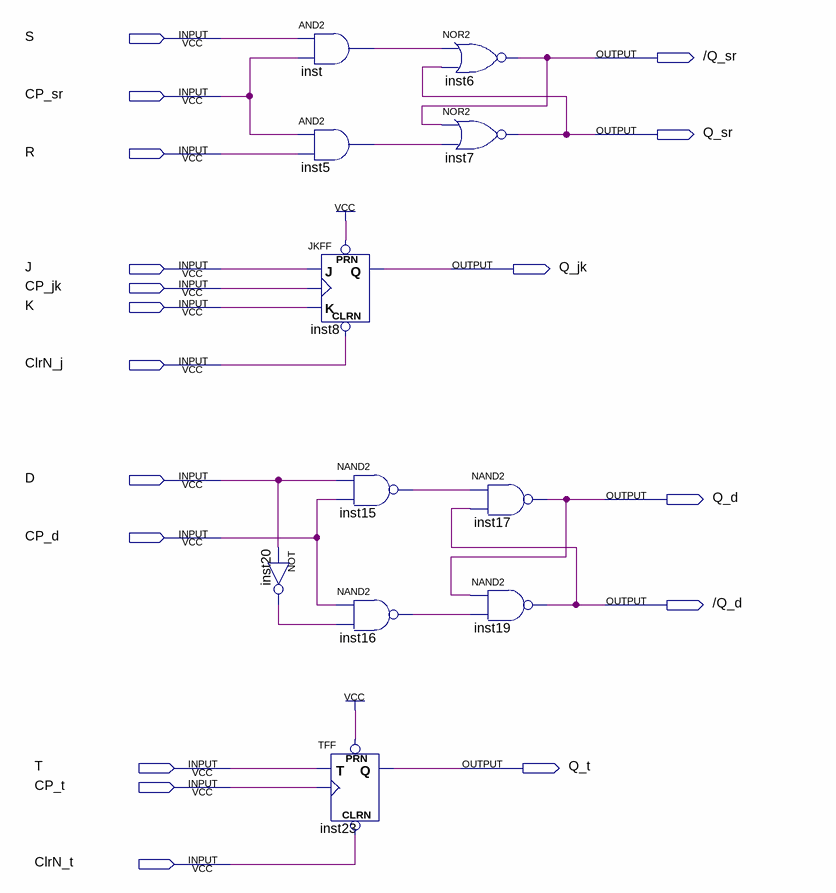
[diagram p0: schematic sheet]
// Quartus schematic ExampleCollection.bdf as structural Verilog: 11 symbols, 18 pins
module ExampleCollection (
  input  S,
  input  CP_sr,
  input  R,
  input  J,
  input  CP_jk,
  input  K,
  input  ClrN_j,
  input  D,
  input  CP_d,
  input  T,
  input  CP_t,
  input  ClrN_t,
  output \/Q_sr ,
  output Q_sr,
  output Q_jk,
  output Q_d,
  output \/Q_d ,
  output Q_t
);

  wire inst5_out, inst15_out, inst16_out, inst20_out, inst_out;

  and inst (inst_out, S, CP_sr);
  and inst5 (inst5_out, CP_sr, R);
  JKFF inst8 (.PRN(1'b1), .CLRN(ClrN_j), .K(K), .J(J), .CLK(CP_jk), .Q(Q_jk));
  not inst20 (inst20_out, D);
  TFF inst23 (.PRN(1'b1), .CLRN(ClrN_t), .T(T), .CLK(CP_t), .Q(Q_t));
  nand inst15 (inst15_out, D, CP_d);
  nand inst16 (inst16_out, CP_d, inst20_out);
  nor inst6 (\/Q_sr , inst_out, Q_sr);
  nor inst7 (Q_sr, \/Q_sr , inst5_out);
  nand inst17 (Q_d, inst15_out, \/Q_d );
  nand inst19 (\/Q_d , Q_d, inst16_out);
endmodule
